# EasyEDA Pro project 轮足机器人主板&核心板.epro, board PCB9
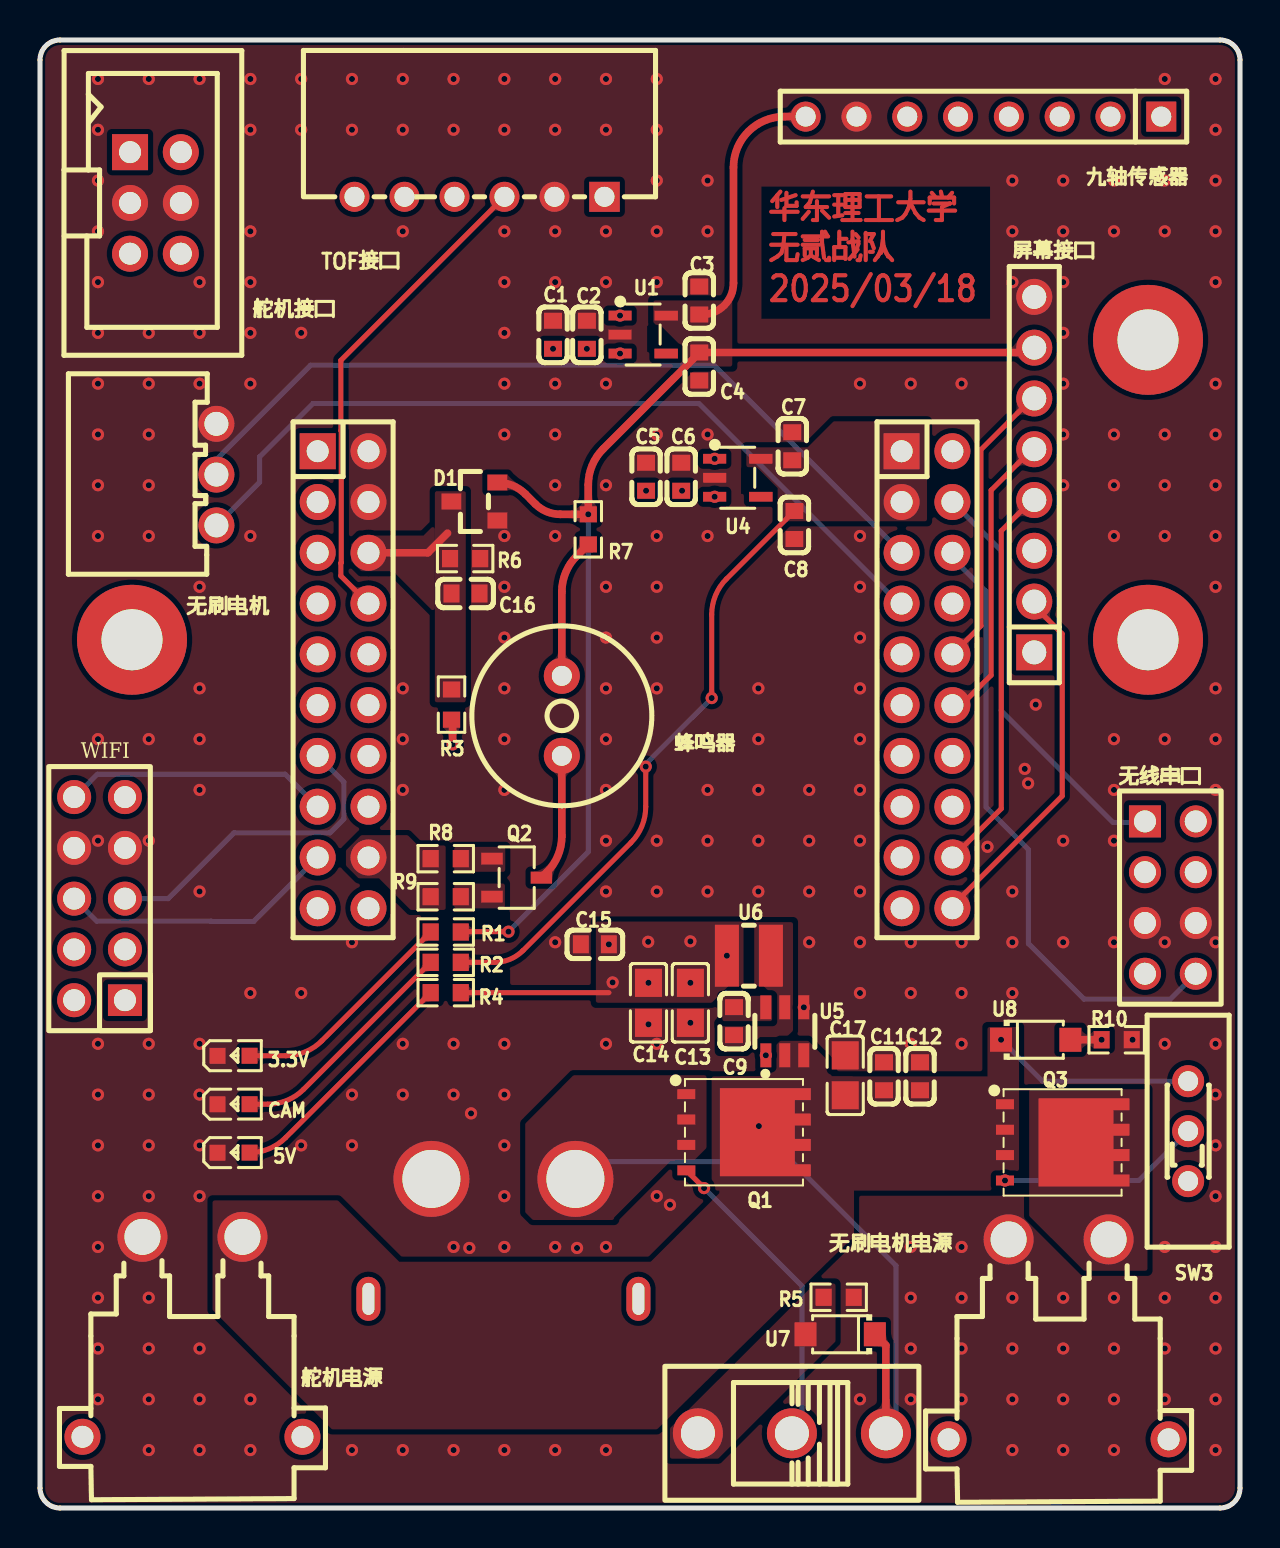
[diagram p11: board, top side]
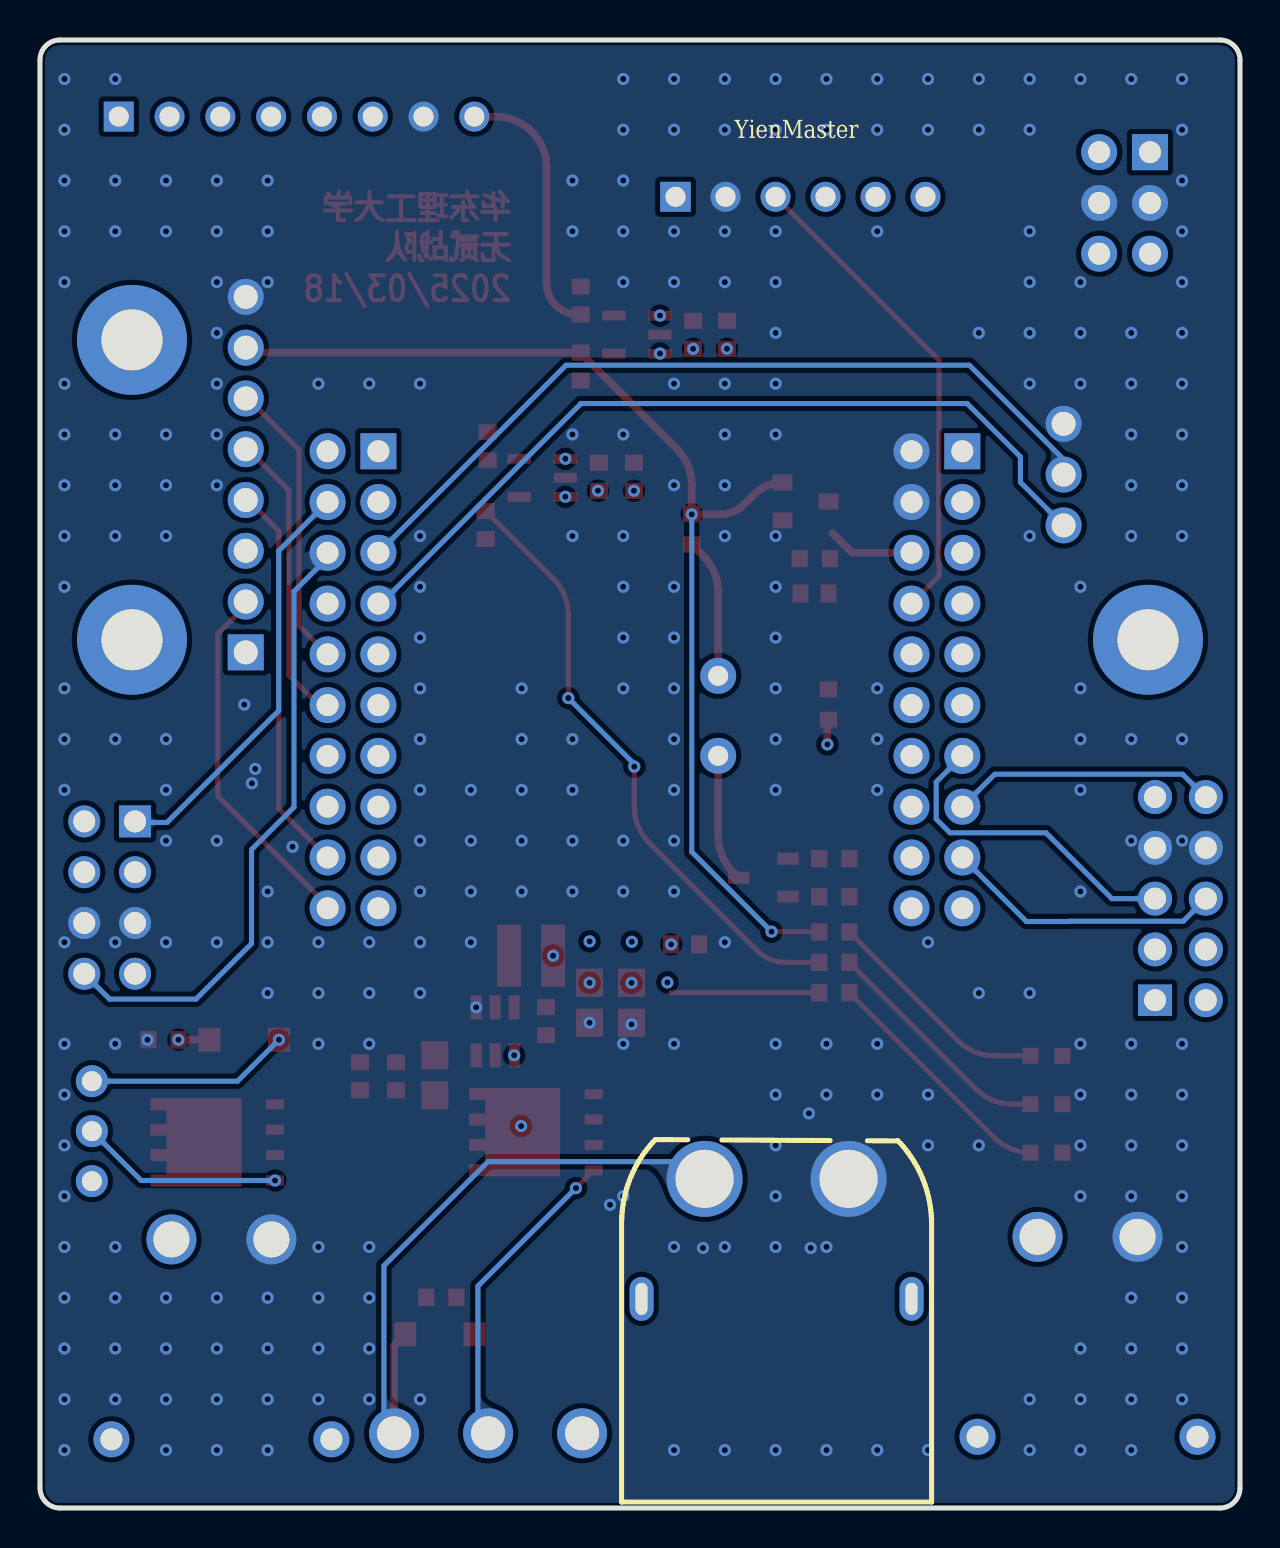
[diagram p12: board, bottom side, seen from below]

Outline 60 x 73.43 mm; copper layers: Top Layer, Inner1, Inner2, Bottom Layer. Coordinates in mm from the lower left corner of the outline.
Outline path: 0,72.43 arc(0.29,73.14) 1,73.43 59,73.43 arc(59.71,73.14) 60,72.43 60,1 arc(59.71,0.29) 59,0 1,0 arc(0.29,0.29) 0,1 0,72.43
Stack: Top Layer 0.035mm 外层铜厚1oz / Dielectric1 0.2104mm 7628 RC49% 8.6mil / Inner1 0.0152mm 内层铜厚 / Dielectric2 1.065mm 1.1mm H/HOZ Copper / Inner2 0.0152mm 内层铜厚 / Dielectric3 0.2104mm 7628 RC49% 8.6mil / Bottom Layer 0.035mm 外层铜厚1oz

## Design rules (mm)
template: 自定义配置
spacing copperThickness1oz (default): track to track 0.102, other pairs 0.152 to 0.3
spacing copperThickness2oz: track to track 0.203, other pairs 0.152 to 0.3
track width copperThickness1oz (default): min 0.127, default 0.254, max 2.54
track width copperThickness2oz: min 0.203, default 0.254, max 2.54
differential pair differentialPair (default): width min 0.127, default 0.254, max 2.54; gap min 0.152, default 0.152
via viaSize (default): diameter min 0.5, default 0.61, max 10; hole min 0.3, default 0.305, max 6.3

## Placement (name value [footprint] x y rotation side)
3.3V  -  [LED_0603]  9.73 22.63 0 top
5V  -  [LED_0603]  9.73 17.78 0 top
C1  10uF  [C0603]  25.65 58.68 270 top
C2  100nF  [C0603]  27.34 58.68 270 top
C3  10uF  [C0603]  32.96 60.4 270 top
C4  100nF  [C0603]  32.96 57.1 90 top
C5  10uF  [C0603]  30.3 51.58 270 top
C6  100nF  [C0603]  32.06 51.58 270 top
C7  10uF  [C0603]  37.61 53.11 270 top
C8  100nF  [C0603]  37.72 49.17 90 top
C9  100nF  [C0603]  34.7 24.35 270 top
C11  100nF  [C0603]  42.2 21.59 270 top
C12  10nF  [C0603]  44 21.59 270 top
C13  22uF  [C0805]  32.52 25.27 90 top
C14  22uF  [C0805]  30.42 25.27 90 top
C15  100nF  [C0603]  27.74 28.19 180 top
C16  100nF  [C0603]  21.28 45.74 180 top
C17  22uF  [C0805]  40.26 21.64 270 top
CAM  -  [LED_0603]  9.73 20.2 0 top
CN3  XT60PW-M  [CONN-TH_XT60PW-M]  23.17 13.46 90 bottom
D1  BAV99  [SOT-23_L2.9-W1.3-P1.90-LS2.4-BR]  21.72 50.35 0 top
Q1  AGM60P100A  [TDSON-8_L5.9-W5.2-P1.27-BL]  34.09 18.8 270 top
Q2  S8050  [SOT-23-3_L2.9-W1.6-P1.90-LS2.8-BR]  23.83 31.53 180 top
Q3  AGM60P100A  [TDSON-8_L5.9-W5.2-P1.27-BL]  50.02 18.29 270 top
R1  2.7k  [R0603]  20.29 28.81 0 top
R2  2.7k  [R0603]  20.29 27.29 0 top
R3  200k  [R0603]  20.58 40.19 270 top
R4  4.7kΩ  [R0603]  20.29 25.78 180 top
R5  10k  [R0603]  39.93 10.54 180 top
R6  22k  [R0603]  21.26 47.49 180 top
R7  10Ω  [R0603]  27.41 48.95 270 top
R8  4.7kΩ  [R0603]  20.29 32.48 0 top
R9  10K  [R0603]  20.29 30.57 0 top
R10  10k  [R0603]  53.83 23.42 180 top
SCREW1  -  [M3螺丝]  55.4 43.43 180 top
SCREW2  -  [M3螺丝]  55.4 58.43 180 top
SCREW4  -  [M3螺丝]  4.6 43.43 180 top
SW1  SS-12D10L3  [SW-TH_SS-12D10L3]  37.59 3.74 180 top
SW3  SS-12E17G3  [SW-TH_HOOYA_SS-12E17G3]  57.41 18.85 90 top
TOF接口  ZX-XH2.54-6PWZ  [CONN-TH_6P-P2.50_ZX-XH2.54-6PWZ]  21.97 65.59 180 top
U1  RT9013-33GB  [SOT-23-5_L3.0-W1.7-P0.95-LS2.8-BL]  30.16 58.7 270 top
U2  PM254-2-10-Z-8.5  [HDR-TH_20P-P2.54-V-F-R2-C10-S2.54]  15.15 41.43 270 top
U3  PM254-2-10-Z-8.5  [HDR-TH_20P-P2.54-V-F-R2-C10-S2.54]  44.35 41.43 270 top
U4  RT9013-33GB  [SOT-23-5_L3.0-W1.7-P0.95-LS2.8-BL]  34.89 51.53 270 top
U5  AP63205WU-7  [TSOT-23-6_L2.9-W1.6-P0.95-LS2.8-BL]  37.24 23.84 0 top
U6  4.7uH  [IND-SMD_L3.0-W3.0_FTC303020D]  35.44 27.63 180 top
U7  BZT52C16  [SOD-123_L2.7-W1.6-LS3.8-RD]  40.01 8.69 180 top
U8  BZT52C16  [SOD-123_L2.7-W1.6-LS3.8-RD]  49.79 23.42 0 top
WIFI  2541FV-2x5P  [HDR-TH_10P-P2.54-V-F-R2-C5-S2.54]  2.98 30.48 90 top
九轴传感器  PZ254V-11-08P  [HDR-TH_8P-P2.54-V-M]  47.17 69.6 180 top
屏幕接口  2.54-1*8P母环保  [HDR-TH_8P-P2.54-V-F-1]  49.71 51.69 90 top
无刷电机  XH-3AW  [CONN-TH_3P-P2.54_HCTL_XH-3AW]  8.82 51.69 90 top
无刷电机电源  XT30PW-M30.G.Y  [CONN-TH_XT30PW-M]  50.93 8.44 0 top
无线串口  2541FV-2x4P  [HDR-TH_8P-P2.54-V-F-R2-C4-S2.54]  56.52 30.53 270 top
舵机接口  BH254V-6P  [IDC-TH_6P-P2.54-V-R2-C3-S2.54]  5.77 65.28 270 top
舵机电源  XT30PW-M30.G.Y  [CONN-TH_XT30PW-M]  7.62 8.56 0 top
蜂鸣器  2.7kHz  [BUZ-TH_BD9.0-P4.00-D0.6-FD]  26.09 39.62 270 top

## Footprints (pads in the part's own frame, mm; a bottom-side part is the same pattern mirrored in y, then rotated)
BUZ-TH_BD9.0-P4.00-D0.6-FD
  round 1.8 hole 1: 1(-2,0) 2(2,0)
C0603
  rect 0.8x0.9 smd: 1(-0.7,0) 2(0.7,0)
C0805
  rect 1.41x1.35 smd: 1(-1,0) 2(1,0)
CONN-TH_3P-P2.54_HCTL_XH-3AW
  round 1.8 hole 1.199: 1(-2.54,0) 2(0.002,0) 3(2.54,0)
CONN-TH_6P-P2.50_ZX-XH2.54-6PWZ
  rect 1.524x1.5 hole 1: 1(-6.25,0)
  round 1.5 hole 1: 2(-3.75,0) 3(-1.25,0) 4(1.25,0) 5(3.75,0) 6(6.25,0)
CONN-TH_XT30PW-M
  round 2.5 hole 1.8: 1(-2.5,5) 2(2.5,5)
  round 1.8 hole 1.1: 3(5.5,-5) 4(-5.5,-5)
CONN-TH_XT60PW-M
  round 3.8 hole 2.9: 1(3,-3.6) 2(3,3.6)
  oval 2.2x1.2 hole 1.6x0.6: 3(-3,6.75) 4(-3,-6.75)
HDR-TH_8P-P2.54-V-F-1
  rect 1.8x1.8 hole 1.2: 1(-8.89,0)
  round 1.8 hole 1.2: 2(-6.35,0) 3(-3.81,0) 4(-1.27,0) 5(1.27,0) 6(3.81,0) 7(6.35,0) 8(8.89,0)
HDR-TH_8P-P2.54-V-F-R2-C4-S2.54
  rect 1.6x1.6 hole 1.1: 1(-3.81,-1.27)
  round 1.6 hole 1.1: 2(-3.81,1.27) 3(-1.27,-1.27) 4(-1.27,1.27) 5(1.27,-1.27) 6(1.27,1.27) 7(3.81,-1.27) 8(3.81,1.27)
HDR-TH_8P-P2.54-V-M
  rect 1.5x1.5 hole 1: 1(-8.89,0)
  round 1.5 hole 1: 2(-6.35,0) 3(-3.81,0) 4(-1.27,0) 5(1.27,0) 6(3.81,0) 7(6.35,0) 8(8.89,0)
HDR-TH_10P-P2.54-V-F-R2-C5-S2.54
  rect 1.575x1.7 hole 1.1: 1(-5.08,-1.27)
  round 1.7 hole 1.1: 2(-5.08,1.27) 3(-2.54,-1.27) 4(-2.54,1.27) 5(0,-1.27) 6(0,1.27) 7(2.54,-1.27) 8(2.54,1.27) 9(5.08,-1.27) 10(5.08,1.27)
HDR-TH_20P-P2.54-V-F-R2-C10-S2.54
  rect 1.8x1.8 hole 1.1: 1(-11.43,-1.27)
  round 1.8 hole 1.1: 2(-11.43,1.27) 3(-8.89,-1.27) 4(-8.89,1.27) 5(-6.35,-1.27) 6(-6.35,1.27) 7(-3.81,-1.27) 8(-3.81,1.27) 9(-1.27,-1.27) 10(-1.27,1.27) 11(1.27,-1.27) 12(1.27,1.27) 13(3.81,-1.27) 14(3.81,1.27) 15(6.35,-1.27) 16(6.35,1.27) 17(8.89,-1.27) 18(8.89,1.27) 19(11.43,-1.27) 20(11.43,1.27)
IDC-TH_6P-P2.54-V-R2-C3-S2.54
  rect 1.8x1.8 hole 1.1: 1(-2.54,-1.27)
  round 1.8 hole 1.1: 2(-2.54,1.27) 3(0,-1.27) 4(0,1.27) 5(2.54,-1.27) 6(2.54,1.27)
IND-SMD_L3.0-W3.0_FTC303020D
  rect 1.2x3.1 smd: 1(-1.1,0) 2(1.1,0)
LED_0603
  rect 0.8x0.8 smd: 1(-0.851,-0.01) 2(0.75,-0.005)
M3螺丝
  round 5.5 hole 3.05: 1(0,0)
R0603
  rect 0.806x0.864 smd: 1(-0.753,0) 2(0.753,0)
SOD-123_L2.7-W1.6-LS3.8-RD
  rect 1.1x1.2 smd: 1(-1.735,0) 2(1.735,0)
SOT-23-3_L2.9-W1.6-P1.90-LS2.8-BR
  rect 1.07x0.6 smd: 1(1.235,-0.95) 2(1.235,0.95) 3(-1.235,0)
SOT-23-5_L3.0-W1.7-P0.95-LS2.8-BL
  rect 0.49x1.157 smd: 1(-0.95,-1.153) 2(0,-1.153) 3(0.95,-1.153)
  rect 0.49x1.175 smd: 4(0.95,1.153) 5(-0.95,1.153)
SOT-23_L2.9-W1.3-P1.90-LS2.4-BR
  rect 1x0.8 smd: 1(1.15,-0.95) 2(1.15,0.95) 3(-1.15,0)
SW-TH_HOOYA_SS-12E17G3
  round 1.6 hole 1: 1(-2.5,0) 2(0,0) 3(2.5,0)
SW-TH_SS-12D10L3
  round 2.5 hole 1.7: 1(-4.7,0) 2(0,0) 3(4.7,0)
TDSON-8_L5.9-W5.2-P1.27-BL
  rect 0.5x0.9 smd: 1(-1.905,-1.775) 2(-0.635,-1.775) 3(0.635,-1.775) 4(1.905,-1.775)
  custom 4.41x4.55 smd: 5(0,1.775)
TSOT-23-6_L2.9-W1.6-P0.95-LS2.8-BL
  rect 0.55x1.2 smd: 1(-0.95,-1.2) 2(0,-1.2) 3(0.95,-1.2) 4(0.95,1.2) 5(0,1.2) 6(-0.95,1.2)

## Nets
As in the schematic, except:
GND: 3.3V.1 5V.1 C1.1 C2.1 C3.1 C4.1 C5.1 C6.1 C7.1 C8.1 C11.1 C12.1 C13.1 C14.1 C15.2 C16.1 C17.1 CAM.1 CN3.1 D1.1 R5.1 R6.1 R10.1 TOF接口.2 U1.2 U2.2 U2.4 U4.2 U5.4 WIFI.7 WIFI.8 九轴传感器.7 屏幕接口.8 无刷电机.3 无刷电机电源.1 无线串口.5 无线串口.6 舵机接口.3 舵机接口.4 舵机电源.1
P33.10: R8.1 R9.1 U2.18
$1N2237: 5V.2 R4.2
$1N3141: 3.3V.2 R1.1
$1N3450: CAM.2 R2.1
$1N3665: Q2.2 R9.2
$1N3667: Q2.1 R8.2

Pads without a net: CN3 3 4; SCREW1 1; SCREW2 1; SCREW4 1; TOF接口 6; U1 4; U4 4; WIFI 2; 九轴传感器 1 2; 无刷电机电源 3 4; 无线串口 2; 舵机电源 3 4

## Via types
v1: diameter 0.61, hole 0.305, Top Layer to Bottom Layer, 303 vias

## Routing (per net, layer and track width the routed paths; a pad name or vN(x,y) marks a point on that pad's centre or on a via; arc(x,y) is an arc through that point)
+5V: length 101.5
  Top Layer w0.254: R4.1 28.45,25.78
  Inner2 w0.381: U2.1 U2.3 ; 33.96,26.67 55.19,26.67 无线串口.7
  Inner2 w0.508: WIFI.9 5.1,35.56 arc(6.07,35.37) 6.9,34.82 10.77,30.94 ; 10.77,30.94 10.77,46.15 arc(10.96,47.12) 11.51,47.95 U2.3 ; 10.77,30.94 15.39,26.32 arc(16.21,25.77) 17.18,25.58 26.8,25.58 ; 31.68,29.84 31.68,53.09
  vias: v1(25.65,57.98) v1(27.34,57.98) v1(28.44,28.19) v1(28.63,26.29) v1(29,59.65) v1(29,57.75) v1(30.3,50.88) v1(30.41,28.32) v1(30.42,26.27) v1(32.1,50.88) v1(32.52,28.34) v1(32.52,26.27) v1(33.73,52.48) v1(33.73,50.58) v1(34.34,27.63) v1(36.29,22.64)
GND:
  vias: v1(2.9,71.48) v1(2.9,68.94) v1(2.9,66.4) v1(2.9,63.86) v1(2.9,61.32) v1(2.9,58.78) v1(2.9,56.24) v1(2.9,53.7) v1(2.9,51.16) v1(2.9,48.62) v1(2.9,38.46) v1(2.9,33.38) v1(2.9,23.22) v1(2.9,20.68) v1(2.9,18.14) v1(2.9,15.6) v1(2.9,13.06) v1(2.9,10.52) v1(2.9,7.98) v1(2.9,5.44) v1(5.44,71.48) v1(5.44,58.78) v1(5.44,56.24) v1(5.44,53.7) v1(5.44,51.16) v1(5.44,48.62) v1(5.44,38.46) v1(5.44,33.38) v1(5.44,23.22) v1(5.44,20.68) v1(5.44,18.14) v1(5.44,15.6) v1(5.44,10.52) v1(5.44,7.98) v1(5.44,5.44) v1(5.44,2.9) v1(7.98,71.48) v1(7.98,61.32) v1(7.98,58.78) v1(7.98,56.24) v1(7.98,46.08) v1(7.98,41) v1(7.98,38.46) v1(7.98,35.92) v1(7.98,30.84) v1(7.98,23.22) v1(7.98,20.68) v1(7.98,18.14) v1(7.98,15.6) v1(7.98,7.98) v1(7.98,5.44) v1(7.98,2.9) v1(10.52,71.48) v1(10.52,68.94) v1(10.52,63.86) v1(10.52,61.32) v1(10.52,58.78) v1(10.52,56.24) v1(10.52,48.62) v1(10.52,25.76) v1(10.52,5.44) v1(10.52,2.9) v1(13.06,71.48) v1(13.06,68.94) v1(13.06,58.78) v1(13.06,25.76) v1(13.06,18.14) v1(15.6,71.48) v1(15.6,68.94) v1(15.6,28.3) v1(15.6,20.68) v1(15.6,18.14) v1(15.6,2.9) v1(18.14,71.48) v1(18.14,68.94) v1(18.14,63.86) v1(18.14,41) v1(18.14,38.46) v1(18.14,35.92) v1(18.14,23.22) v1(18.14,20.68) v1(18.14,2.9) v1(20.68,71.48) v1(20.68,68.94) v1(20.68,23.22) v1(20.68,20.68) v1(20.68,13.06) v1(20.68,2.9) v1(21.47,13.01) v1(21.55,19.74) v1(23.22,71.48) v1(23.22,68.94) v1(23.22,63.86) v1(23.22,61.32) v1(23.22,58.78) v1(23.22,56.24) v1(23.22,53.7) v1(23.22,48.62) v1(23.22,46.08) v1(23.22,43.54) v1(23.22,41) v1(23.22,38.46) v1(23.22,35.92) v1(23.22,23.22) v1(23.22,20.68) v1(23.22,18.14) v1(23.22,15.6) v1(23.22,13.06) v1(23.22,2.9) v1(25.76,71.48) v1(25.76,68.94) v1(25.76,63.86) v1(25.76,61.32) v1(25.76,56.24) v1(25.76,53.7) v1(25.76,51.16) v1(25.76,48.62) v1(25.76,28.3) v1(25.76,13.06) v1(25.76,2.9) v1(26.85,13.01) v1(28.3,71.48) v1(28.3,68.94) v1(28.3,63.86) v1(28.3,61.32) v1(28.3,56.24) v1(28.3,51.16) v1(28.3,46.08) v1(28.3,43.54) v1(28.3,41) v1(28.3,38.46) v1(28.3,35.92) v1(28.3,33.38) v1(28.3,30.84) v1(28.3,23.22) v1(28.3,13.06) v1(28.3,2.9) v1(30.42,24.19) v1(30.84,71.48) v1(30.84,68.94) v1(30.84,66.4) v1(30.84,63.86) v1(30.84,61.32) v1(30.84,53.7) v1(30.84,48.62) v1(30.84,46.08) v1(30.84,43.54) v1(30.84,41) v1(30.84,33.38) v1(30.84,30.84) v1(30.84,23.22) v1(30.84,15.6) v1(31.5,15.17) v1(32.52,24.27) v1(33.38,66.4) v1(33.38,63.86) v1(33.38,53.7) v1(33.38,48.62) v1(33.38,38.46) v1(33.38,35.92) v1(33.38,33.38) v1(33.38,30.84) v1(35.92,41) v1(35.92,38.46) v1(35.92,35.92) v1(35.92,33.38) v1(35.92,30.84) v1(38.19,25.04) v1(38.46,35.92) v1(38.46,33.38) v1(38.46,30.84) v1(38.46,28.3) v1(41,56.24) v1(41,48.62) v1(41,46.08) v1(41,43.54) v1(41,41) v1(41,38.46) v1(41,35.92) v1(41,33.38) v1(41,30.84) v1(41,28.3) v1(41,25.76) v1(41,5.44) v1(43.54,56.24) v1(43.54,28.3) v1(43.54,25.76) v1(43.54,23.22) v1(43.54,13.06) v1(43.54,10.52) v1(43.54,7.98) v1(43.54,5.44) v1(46.08,56.24) v1(46.08,28.3) v1(46.08,25.76) v1(46.08,23.22) v1(46.08,13.06) v1(46.08,10.52) v1(46.08,7.98) v1(46.08,5.44) v1(47.37,33.07) v1(48.62,66.4) v1(48.62,63.86) v1(48.62,61.32) v1(48.62,30.84) v1(48.62,28.3) v1(48.62,25.76) v1(48.62,10.52) v1(48.62,7.98) v1(48.62,5.44) v1(48.62,2.9) v1(49.24,36.97) v1(49.41,36.25) v1(49.79,40.19) v1(51.16,66.4) v1(51.16,63.86) v1(51.16,61.32) v1(51.16,58.78) v1(51.16,56.24) v1(51.16,53.7) v1(51.16,51.16) v1(51.16,33.38) v1(51.16,28.3) v1(51.16,10.52) v1(51.16,7.98) v1(51.16,5.44) v1(51.16,2.9) v1(53.7,66.4) v1(53.7,63.86) v1(53.7,53.7) v1(53.7,51.16) v1(53.7,48.62) v1(53.7,38.46) v1(53.7,35.92) v1(53.7,33.38) v1(53.7,28.3) v1(53.7,10.52) v1(53.7,7.98) v1(53.7,5.44) v1(53.7,2.9) v1(54.63,23.42) v1(56.24,71.48) v1(56.24,66.4) v1(56.24,63.86) v1(56.24,53.7) v1(56.24,51.16) v1(56.24,48.62) v1(56.24,38.46) v1(56.24,28.3) v1(56.24,23.22) v1(56.24,13.06) v1(56.24,10.52) v1(56.24,7.98) v1(56.24,5.44) v1(58.78,71.48) v1(58.78,68.94) v1(58.78,66.4) v1(58.78,63.86) v1(58.78,61.32) v1(58.78,56.24) v1(58.78,53.7) v1(58.78,51.16) v1(58.78,48.62) v1(58.78,46.08) v1(58.78,41) v1(58.78,38.46) v1(58.78,35.92) v1(58.78,28.3) v1(58.78,23.22) v1(58.78,20.68) v1(58.78,18.14) v1(58.78,15.6) v1(58.78,13.06) v1(58.78,10.52) v1(58.78,7.98) v1(58.78,5.44) v1(58.78,2.9)
VCC3V3: length 70.3
  Top Layer w0.254: v1(23.42,28.83) 21.06,28.83 R1.2
  Top Layer w0.381: 49.46,58.04 49.22,57.8 C4.2 arc(32.96,57.78) 32.95,57.77 28.16,52.97 arc(27.61,52.15) 27.41,51.18 v1(27.41,49.7) 26.01,49.7 arc(25.34,49.84) 24.77,50.22 24.27,50.71 arc(23.63,51.14) D1.2 ; 九轴传感器.8 37.21,69.6 arc(35.42,68.85) 34.67,67.06 34.67,61.27 arc(34.21,60.16) 33.1,59.7 C3.2
  Bottom Layer w0.254: v1(23.42,28.83) 27.41,32.82 v1(27.41,49.7)
VCCCAM: length 30.7
  Top Layer w0.254: v1(30.29,37.08) 30.29,35.07 arc(30.09,34.1) 29.54,33.28 24.15,27.88 arc(23.5,27.45) 22.73,27.29 R2.2 ; C8.2 34.33,46.48 arc(33.78,45.66) 33.58,44.68 v1(33.58,40.51)
  Bottom Layer w0.254: v1(30.29,37.08) 30.29,37.21 v1(33.58,40.51)
VIN_BAT: length 40
  Top Layer w0.381: R3.2 20.63,39.38 v1(20.63,38.19)
  Inner1 w0.381: v1(20.63,38.19) 20.63,29.08 30.61,19.1 v1(35.94,19.1)
  Bottom Layer w0.254: v1(48.05,23.42) 50.12,21.35 SW3.3
AN20: length 4.4
  Top Layer w0.381: U2.6 19.39,47.78 20.38,48.76
DCIN: length 32.3
  Top Layer w0.381: 42.8,3.74 42.29,4.25 42.29,8.14 U7.1
  Bottom Layer w0.254: CN3.2 27.63,17.33 37.59,17.33 42.8,12.12 42.8,3.74
P10.2: length 24.5
  Inner2 w0.254: U3.8 47.37,43.49 47.37,33.96 50.93,30.41 56.39,30.41 无线串口.4
P10.5: length 21
  Bottom Layer w0.254: 无线串口.1 55.19,34.29 53.65,34.29 48.06,39.88 48.06,47.88 U3.4
P10.6: length 27.2
  Inner2 w0.254: U3.2 48.14,50.34 48.14,35.23 51.62,31.75 55.19,31.75 无线串口.3
P11.6: length 31.2
  Bottom Layer w0.254: U3.6 45.62,47.53 47.3,45.85 47.3,35.06 49.42,32.93 49.42,28.23 52.2,25.45 56.52,25.45 无线串口.8
P15.0: length 16.6
  Inner1 w0.254: 49.46,47.88 屏幕接口.3 51.49,46.1 51.49,40.26 46.31,35.08 U3.16
P15.1: length 19.5
  Top Layer w0.254: 49.46,50.42 49.46,50.27 48.06,48.87 48.06,34.98 U3.18
P15.2: length 18.3
  Top Layer w0.254: 49.46,45.34 49.49,45.34 51.11,43.72 51.11,35.62 45.62,30.13 U3.20
P15.3: length 14.4
  Top Layer w0.254: U3.10 47.05,44.12 47.05,52.94 49.46,55.35 49.46,55.5
P15.4: length 6.9
  Inner1 w0.254: 49.46,42.8 49.66,42.6 49.66,41.66 U3.14
P15.5: length 14.6
  Top Layer w0.254: U3.12 46.06,40.16 47.55,41.66 47.55,50.91 49.46,52.81 49.46,52.96
P15.6: length 41.7
  Bottom Layer w0.254: 无刷电机.1 10.98,51.31 10.98,52.58 13.64,55.24 32.95,55.24 42.95,45.24 U3.7
P15.7: length 40.9
  Bottom Layer w0.254: 无刷电机.2 8.82,52.45 13.53,57.16 33.7,57.16 U3.5
P15.8: length 14
  Bottom Layer w0.254: U2.17 10.68,29.34 8.56,29.34 8.55,29.35 2.84,29.35 WIFI.6
P20.10: length 51.6
  Inner1 w0.254: U3.15 36.38,41.78 36.38,62.48 30.86,68 20.64,68 TOF接口.5
P20.11: length 36.1
  Inner1 w0.254: U3.13 38.23,42.47 38.23,64.46 九轴传感器.6
P20.12: length 34.1
  Inner1 w0.254: 九轴传感器.4 40.13,61.29 40.13,43.23 43.08,40.29 U3.11
P20.13: length 42.9
  Inner2 w0.254: 九轴传感器.3 44.33,62.94 44.33,31.24 U3.19
P20.14: length 40.9
  Inner2 w0.254: 九轴传感器.5 39.88,63.57 39.88,35.74 U3.17
P22.0: length 16.3
  Bottom Layer w0.254: WIFI.5 6.41,30.48 9.7,33.77 14.5,33.77 15.19,34.46 15.19,36.31 U2.13
P22.1: length 20.4
  Inner1 w0.254: U2.11 12.12,38.4 12.12,30.48 7.04,25.4 WIFI.1
P22.2: length 25.1
  Inner1 w0.254: U2.9 13.29,42.7 11.31,40.71 11.31,30.81 7.17,26.67 2.98,26.67 WIFI.4
P22.3: length 22.8
  Inner1 w0.254: U2.7 13.29,45.24 10.42,42.36 10.42,32.2 6.15,27.94 WIFI.3
P23.1: length 13.3
  Bottom Layer w0.254: 1.73,35.56 2.87,36.7 12.26,36.7 U2.15
P33.4: length 24.3
  Top Layer w0.254: U2.8 15.04,46.62 15.04,47.27 15.06,47.29 15.06,53.87 15.04,53.9 15.04,57.4 TOF接口.3
P33.5: length 24.7
  Inner1 w0.254: TOF接口.4 20.72,47 U2.10
P33.6: length 33.1
  Inner2 w0.254: 舵机接口.5 7.8,59.44 14.53,59.44 18.34,55.63 18.34,42.08 U2.12
P33.7: length 40.2
  Inner2 w0.254: 舵机接口.1 4.5,67.69 5.64,66.55 10.09,66.55 19.43,57.2 19.43,40.76 16.42,37.75 U2.14
P33.8: length 42.7
  Inner2 w0.254: 舵机接口.2 11.49,67.82 20.58,58.73 20.58,39.23 U2.16
P33.13: length 39.5
  Inner1 w0.254: 舵机接口.6 11.99,62.74 15.06,59.67 15.06,31.36 U2.20
$1N2237: length 12.3
  Top Layer w0.254: R4.2 12.27,18.52 arc(11.45,17.97) 10.48,17.77
$1N3141: length 11.5
  Top Layer w0.254: R1.1 14.09,23.37 arc(13.26,22.82) 12.29,22.62 3.3V.2
$1N3450: length 11.9
  Top Layer w0.254: CAM.2 11.39,20.2 arc(12.36,20.39) 13.18,20.94 R2.1
$1N3666: length 6.4
  Top Layer w0.381: Q2.3 25.35,31.81 arc(25.9,32.63) 26.09,33.61 蜂鸣器.2
$1N3671: length 7
  Top Layer w0.381: R7.2 26.83,47.62 arc(26.28,46.79) 26.09,45.82 蜂鸣器.1
$1N3951: length 15.6
  Top Layer w0.254: v1(33.2,16) 33.2,16 Q1.4
  Bottom Layer w0.254: v1(33.2,16) 38.1,11.1 38.1,3.74
$1N12313: length 10.4
  Top Layer w0.381: U8.2 v1(53.08,23.42)
  Inner1 w0.254: v1(53.08,23.42) 53.08,20.68 SW3.1
$1N12314: length 10.2
  Bottom Layer w0.254: v1(48.25,16.38) 54.94,16.38 SW3.2

## Copper pours and planes (outline as drawn; the poured copper is in the pictures)
+5V on Top Layer: 35.17,26.1 34.41,26.1 33.58,25.27 27.79,25.27 27.79,29.34 35.17,29.34
+5V on Inner2: 34.22,50.16 31.68,47.62 31.68,47.75 28.5,50.93 33.46,50.93
+5V on Inner2: 29.21,66.6 27.43,66.6 26.93,66.09 26.93,63.09 24.06,60.22 29.77,60.22 29.77,66.04
+5V on Inner2: 24.08,25.53 27.61,30.46 27.61,24.35
+5V on Inner2: 35.99,30.48 35.99,24.35 38.6,26.67 36,30.49
+5V on Inner2: 35.99,30.48 35.99,32.85 31.68,37.17 27.61,33.1 27.61,30.48 27.62,30.48
+5V on Inner2: 34.22,50.16 34.22,53.09 29.77,57.53 29.77,60.22 24.06,60.22 24.06,55.37 29.27,50.16
+5V on Inner2: 36.02,24.35 27.61,24.35 27.61,30.48 36.02,30.48
+5V on Inner2: 37.01,25.42 37.01,21.97 36.18,21.97 33.8,24.35
GND on Top Layer: 62.16,-0.89 -2.1,-0.89 -2.1,75.44 62.16,75.44
GND on Bottom Layer: 69.65,-4.32 -9.98,-4.32 -9.98,83.44 69.65,83.44
GND on Inner1: -15.11,87.94 74.42,87.94 74.42,-7.57 -15.11,-7.57
GND on Inner2: 66.98,-1.4 -7.82,-1.4 -7.82,80.9 66.98,80.9
VCC on Top Layer: 49.46,20.95 49.46,14.61 52.2,11.86 55.37,11.86 55.37,20.95
VCC3V3 on Top Layer: 34.61,57.1 31.92,57.1 31.92,58.26 31.01,59.17 30.8,59.17 30.66,59.31 30.66,60.4 34.61,60.4
VCCCAM on Top Layer: 44.35,49.36 36.88,49.36 36.88,51.01 35.83,52.06 35.32,52.06 35.32,53.06 38.38,53.06 39.68,54.36 44.35,54.36
VIN_BAT on Top Layer: 33.96,21.59 40.7,21.59 40.7,13.59 30.85,3.94 14.6,3.94 8.63,9.91 8.63,15.39 14.9,15.39 17.96,12.32 30.54,12.32 33.96,15.75
VIN_BAT on Top Layer: 36.27,21.46 39.59,21.46 39.59,22.19 38.41,23.37 37.01,23.37 36.76,23.11 36.76,21.96
VIN_BAT on Top Layer: 33.58,15.87 48.95,15.87 48.95,21.59 33.58,21.59
VIN_BAT on Top Layer: 47.37,24.06 48.95,24.06 48.95,20.89 47.37,20.89
AN20 on Top Layer: 19.74,49.21 19.74,44.77 17.65,46.85 16.07,46.85 15.55,47.37 15.55,48.2 15.99,48.64 19.17,48.64
AN20 on Top Layer: 21.29,40.3 19.74,40.3 19.74,50.86 21.29,50.86
DCIN on Top Layer: 28.7,14.4 28.7,14.53 31.5,17.33 32.64,17.33 33.4,18.09 33.4,21.64 26.67,21.64 24.26,19.23 24.26,14.79 24.64,14.4
P33.10 on Top Layer: 20.29,29.91 18.53,29.91 16.95,31.5 15.93,31.5 15.3,32.13 15.3,32.89 16.06,33.65 18.39,33.65 18.9,33.14 20.29,33.14
$1N1518 on Top Layer: 36.61,25.62 36.61,24.35 34.12,24.35 34.12,25.62
$1N1522 on Top Layer: 33.99,24.07 33.99,22.86 35.3,22.86 35.99,23.55 37.33,23.55 37.65,23.88 37.65,29.31 35.71,29.31 35.71,26.1 36.18,26.1 36.76,25.53 36.76,24.33 34.04,24.33 33.96,24.26 33.96,24.1
$1N3665 on Top Layer: 23.24,30 20.71,30 20.71,31.24 23.24,31.24
$1N3667 on Top Layer: 23.26,31.82 20.71,31.82 20.71,33.07 23.26,33.07
$1N3950 on Top Layer: 39.75,11.23 38.74,11.23 31.5,3.99 31.5,2.47 33.91,2.47 39.77,8.33 39.77,11.21

Small or netless copper shapes (teardrops, artwork), in the pictures only: 49 on Top Layer, 26 on Bottom Layer, 24 on Inner1, 21 on Inner2

## Text on the board
Bottom Solder Mask Layer: 华东理工大学 / 无贰战队 / 主板V3.1 / 2025/03/18
Bottom Silkscreen Layer: YienMaster
Top Layer: 华东理工大学 / 无贰战队 / 2025/03/18
